# Altium schematic sheet Reset.SchDoc: Reset
size A; Author: Micheal Burin; Revision: 1.0; SheetNumber: 5; SheetTotal: 10
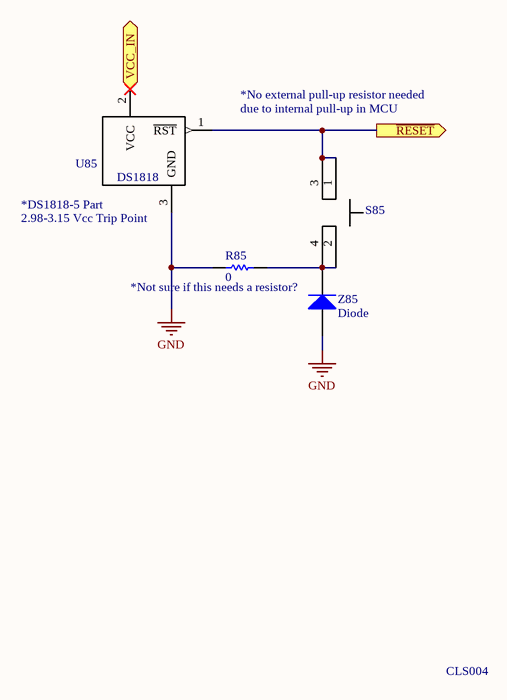
[diagram p0: Reset.SchDoc]

## Parts
R85  value 0  [0603_CHIP_FP]  (hidden comment: Resistor)
S85  Switch  [Pushbutton]  (value not drawn)
U85  DS1818  [SOT95P240X110-3N]
Z85  Diode  [0603_CHIP_FP]

## Ports
VCC_IN (in), ~{RESET} (out)

## Nets
GND: R85.1 U85.3(GND) Z85.2(Cathode)
~{RESET}: S85.1 S85.3 U85.1(~{RST}) ; port ~{RESET}
VCC_IN: U85.2(VCC) ; port VCC_IN
NetR85_2: R85.2 S85.2 S85.4 Z85.1(Anode)

## Notes on the sheet
- *No external pull-up resistor needed
- due to internal pull-up in MCU
- (near U85) *DS1818-5 Part
- (near U85) 2.98-3.15 Vcc Trip Point
- (near Z85) *Not sure if this needs a resistor?
- CLS004

## Library data of the parts
R85 = Resistor_0603: Manufacturer: Vishay Dale; Manufacturer Part Number: CRCW08050000Z0EA; Vendor Part Number: 541-0.0ACT-ND; Vendor: Digikey; Vendor Description: RES SMD 0 OHM JUMPER 1/8W 0805; ComponentLink1Description: Datasheet; ComponentLink1URL: https://www.digikey.com/product-detail/en/vishay-dale/CRCW08050000Z0EA/541-0.0ACT-ND/1180267; Cost: .04
S85 = Pushbutton: Pushbutton Switch; Manufacturer: APEM Inc.; Manufacturer Part Number: MJTP1230; Vendor Part Number: 679-2428-ND; Vendor: Digikey; Vendor Description: SWITCH TACTILE SPST-NO 0.05A 12V; ComponentLink1Description: Datasheet; ComponentLink1URL: https://www.digikey.com/product-detail/en/apem-inc/MJTP1230/679-2428-ND/1798037; Cost: .11
U85 = DS1818_5: 3.3V EconoReset with Pushbutton; Manufacturer: Maxim Integrated; Manufacturer Part Number: DS1818R-5+T&R; Vendor Part Number: DS1818R-5+CT-ND; Value: 3.06V; Vendor: Digikey; Vendor Description: IC 3.06V W/PB 5% SOT23-3; ComponentLink1Description: Datasheet; ComponentLink1URL: https://www.digikey.com/product-detail/en/maxim-integrated/DS1818R-5-T-R/DS1818R-5-CT-ND/1566808; Cost: 2.62
Z85 = Diode: Default Diode; Manufacturer: STMicroelectronics; Manufacturer Part Number: ESDA7P120-1U1M; Vendor Part Number: 497-17159-1-ND; Vendor: Digikey; Vendor Description: TVS DIODE 5.5V 11.5V 1610; ComponentLink1Description: Datasheet; ComponentLink1URL: https://www.digikey.com/product-detail/en/stmicroelectronics/ESDA7P120-1U1M/497-17159-1-ND/6709859; Cost: .38